# Altium schematic sheet 13_PRAM.SchDoc
size 420 x 297 mm; SheetNumber: 23; SheetTotal: 36
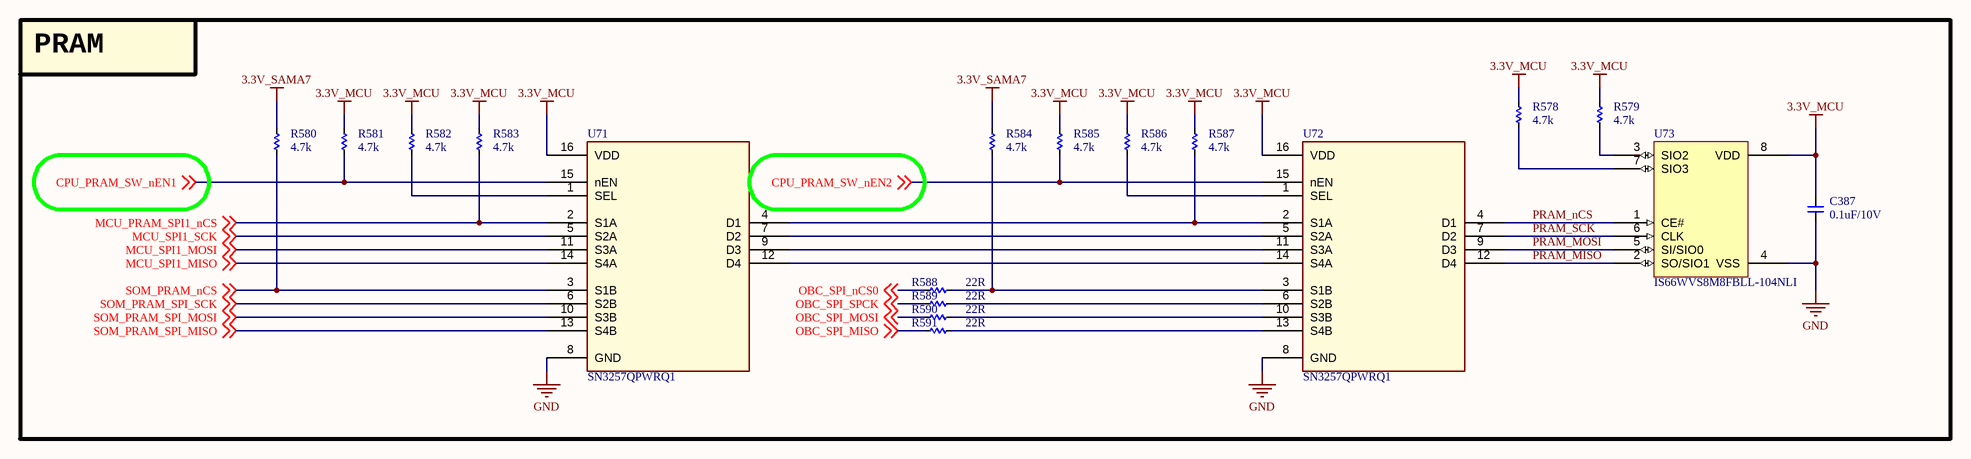
[diagram p0: 13_PRAM.SchDoc]

## Parts
C387  0.1uF/10V  [CAP_C_1005X50_L]
R578  4.7k  [RES_C_1005x30_L]
R579  4.7k  [RES_C_1005x30_L]
R580  4.7k  [RES_C_1005x30_L]
R581  4.7k  [RES_C_1005x30_L]
R582  4.7k  [RES_C_1005x30_L]
R583  4.7k  [RES_C_1005x30_L]
R584  4.7k  [RES_C_1005x30_L]
R585  4.7k  [RES_C_1005x30_L]
R586  4.7k  [RES_C_1005x30_L]
R587  4.7k  [RES_C_1005x30_L]
R588  22R  [RES_C_1005x30_L]
R589  22R  [RES_C_1005x30_L]
R590  22R  [RES_C_1005x30_L]
R591  22R  [RES_C_1005x30_L]
U71  SN3257QPWRQ1  [SOIC_PRQ1_TEX]
U72  SN3257QPWRQ1  [SOIC_PRQ1_TEX]
U73  IS66WVS8M8FBLL-104NLI  [SOIC8_150MIL_N_ISI]

## Blocks framed on the sheet
PRAM: C387 R578-R591 U71-U73

## Nets
3.3V_MCU: C387.1 R578.2 R579.2 R581.2 R582.2 R583.2 R585.2 R586.2 R587.2 U71.16(VDD) U72.16(VDD) U73.8(VDD)
3.3V_SAMA7: R580.2 R584.2
GND: C387.2 U71.8(GND) U72.8(GND) U73.4(VSS)
CPU_PRAM_SW_nEN1: R581.1 U71.15(nEN) ; off-sheet CPU_PRAM_SW_nEN1
CPU_PRAM_SW_nEN2: R585.1 U72.15(nEN) ; off-sheet CPU_PRAM_SW_nEN2
MCU_PRAM_SPI1_nCS: R583.1 U71.2(S1A) ; off-sheet MCU_PRAM_SPI1_nCS
MCU_SPI1_MISO: U71.14(S4A) ; off-sheet MCU_SPI1_MISO
MCU_SPI1_MOSI: U71.11(S3A) ; off-sheet MCU_SPI1_MOSI
MCU_SPI1_SCK: U71.5(S2A) ; off-sheet MCU_SPI1_SCK
OBC_SPI_MISO: R591.2 ; off-sheet OBC_SPI_MISO
OBC_SPI_MOSI: R590.2 ; off-sheet OBC_SPI_MOSI
OBC_SPI_nCS0: R588.2 ; off-sheet OBC_SPI_nCS0
OBC_SPI_SPCK: R589.2 ; off-sheet OBC_SPI_SPCK
PRAM_MISO: U72.12(D4) U73.2(SO/SIO1)
PRAM_MOSI: U72.9(D3) U73.5(SI/SIO0)
PRAM_nCS: U72.4(D1) U73.1(CE#)
PRAM_SCK: U72.7(D2) U73.6(CLK)
SOM_PRAM_nCS: R580.1 U71.3(S1B) ; off-sheet SOM_PRAM_nCS
SOM_PRAM_SPI_MISO: U71.13(S4B) ; off-sheet SOM_PRAM_SPI_MISO
SOM_PRAM_SPI_MOSI: U71.10(S3B) ; off-sheet SOM_PRAM_SPI_MOSI
SOM_PRAM_SPI_SCK: U71.6(S2B) ; off-sheet SOM_PRAM_SPI_SCK
NetR578_1: R578.1 U73.7(SIO3)
NetR579_1: R579.1 U73.3(SIO2)
NetR582_1: R582.1 U71.1(SEL)
NetR584_1: R584.1 R588.1 U72.3(S1B)
NetR586_1: R586.1 U72.1(SEL)
NetR587_1: R587.1 U71.4(D1) U72.2(S1A)
NetR589_1: R589.1 U72.6(S2B)
NetR590_1: R590.1 U72.10(S3B)
NetR591_1: R591.1 U72.13(S4B)
NetU71_7: U71.7(D2) U72.5(S2A)
NetU71_9: U71.9(D3) U72.11(S3A)
NetU71_12: U71.12(D4) U72.14(S4A)

## Notes on the sheet
- Project:
- Sub-system:
- Design by:
- Sheet title:
- Sheet
- of
- Checked by:
- Approved by:
- Revision:
- Document No:
- Size:
- Date:
- A3

## Library data of the parts
C387 = _CAP_C_2: CAP
R578-R591 = _RES_B_2: RES
U71 U72 = IC_SW_SPI_SN3257QPWRQ1: Automotive 5-V, 2:1 (SPDT), 4-channel switch with 1.8-V logic and powered-off protection 16-TSSOP -40 to 125; Manufacturer_Name: Texas Instruments; Copyright: Copyright (C) 2025 Ultra Librarian. All rights reserved.; Manufacturer_Part_Number: SN3257QPWRQ1; Datasheet: https://www.ti.com/lit/gpn/sn3257-q1; RefDes: RefDes; Type: Type
U73 = IS66WVS4M8BLL-104NLI: No Description Available; Manufacturer_Name: ISSI; Type: Memory; Copyright: Copyright (C) 2025 Ultra Librarian. All rights reserved.; Manufacturer_Part_Number: IS66WVS4M8BLL-104NLI; RefDes: RefDes